# Altium schematic sheet USB_OTG_FS.SchDoc
size A4; DocumentNumber: 5; Revision: C.1(PCB.SCH); SheetNumber: 5; SheetTotal: 6
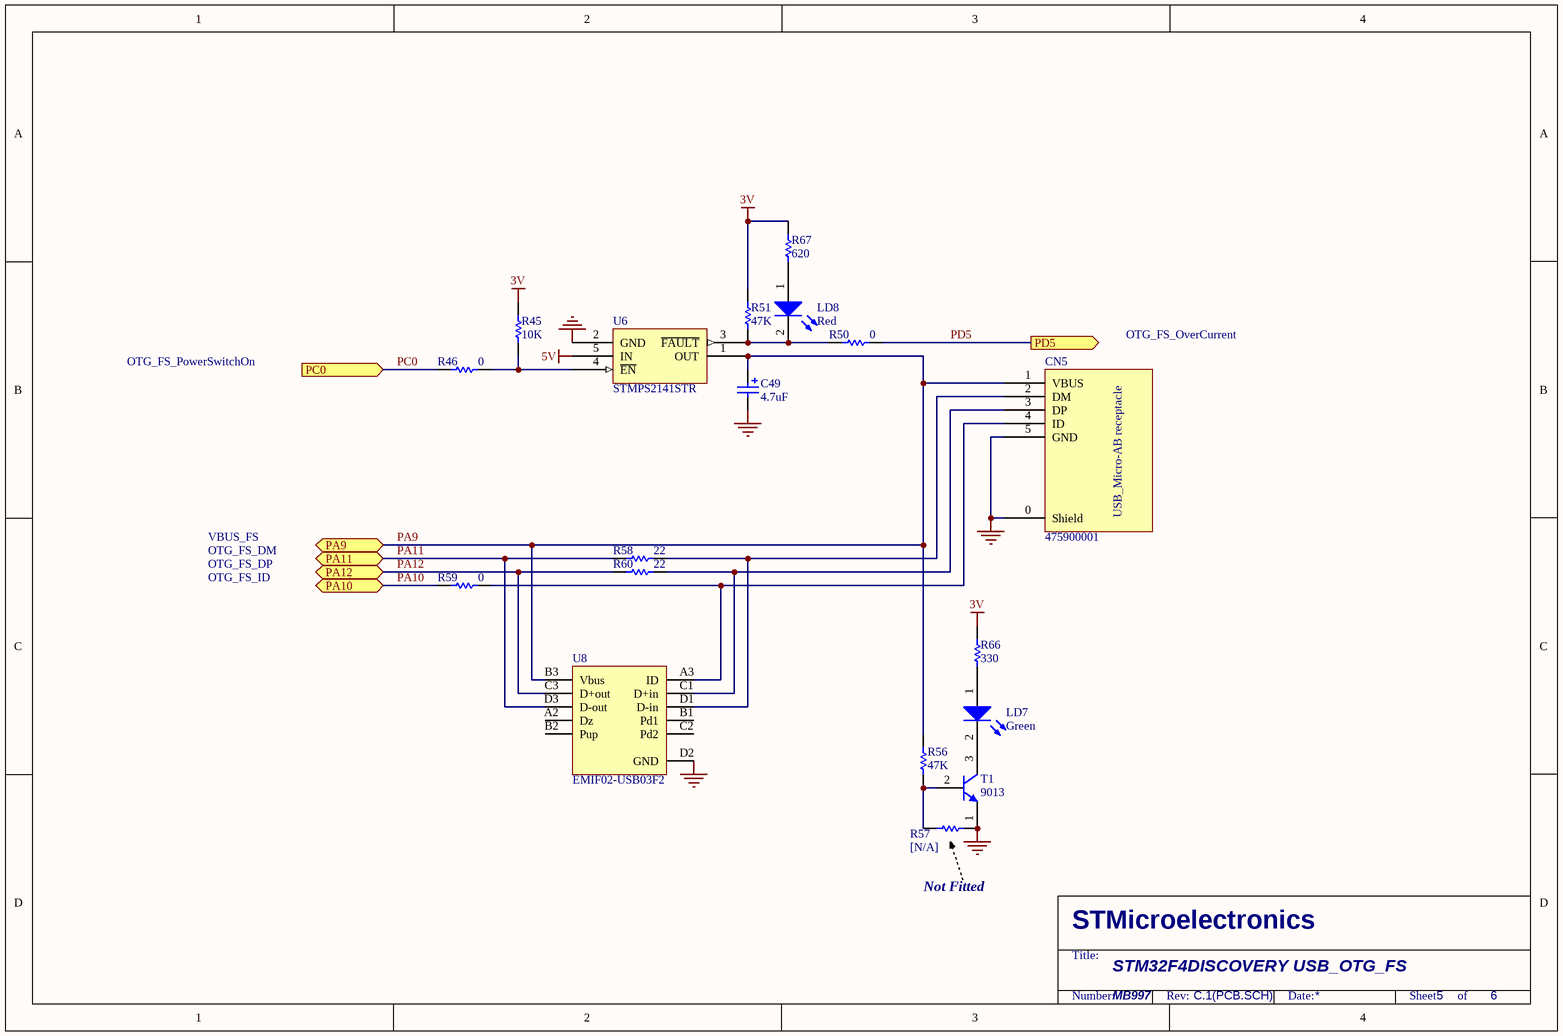
[diagram p0: USB_OTG_FS.SchDoc]

## Parts
C49  4.7uF  [TAN-A]
CN5  475900001  [USB-MICRO-AB]
LD7  Green  [0603D]
LD8  Red  [0603D]
R45  10K  [0402R]
R46  0  [0603R]
R50  0  [0603R]
R51  47K  [0402R]
R56  47K  [0402R]
R57  [N/A]  [0603R]
R58  22  [0603R]
R59  0  [0603R]
R60  22  [0603R]
R66  330  [0603R]
R67  620  [0603R]
T1  9013  [SOT-23]
U6  STMPS2141STR  [SOT23-5L]
U8  EMIF02-USB03F2  [Flip Chip]

## Ports
PA9 (bidir), PA10 (bidir), PA11 (bidir), PA12 (bidir), PC0 (in), PD5 (out)

## Nets
3V: R45.1 R51.1 R66.2 R67.2
5V: U6.5(IN)
GND: C49.2 CN5.0(Shield) CN5.5(GND) R57.1 T1.1(E) U6.2(GND) U8.D2(GND)
PA9: C49.1 CN5.1(VBUS) R56.2 U6.1(OUT) U8.B3(Vbus) ; port PA9
PA10: R59.2 ; port PA10
PA11: R58.2 U8.D3(D-out) ; port PA11
PA12: R60.2 U8.C3(D+out) ; port PA12
PC0: R46.2 ; port PC0
PD5: R50.1 ; port PD5
NetCN5_2: CN5.2(DM) R58.1 U8.D1(D-in)
NetCN5_3: CN5.3(DP) R60.1 U8.C1(D+in)
NetCN5_4: CN5.4(ID) R59.1 U8.A3(ID)
NetLD7_1: LD7.1(A) R66.1
NetLD7_2: LD7.2(K) T1.3(C)
NetLD8_1: LD8.1(A) R67.1
NetLD8_2: LD8.2(K) R50.2 R51.2 U6.3(~{FAULT})
NetR45_2: R45.2 R46.1 U6.4(~{EN})
NetR56_1: R56.1 R57.2 T1.2(B)

Not connected (* = marked no-connect by the designer): U8 A2(Dz) B1(Pd1) B2(Pup) C2(Pd2)

## Notes on the sheet
- OTG_FS_PowerSwitchOn
- OTG_FS_OverCurrent
- VBUS_FS
- OTG_FS_ID
- OTG_FS_DM
- OTG_FS_DP
- Not Fitted
- STM32F4DISCOVERY USB_OTG_FS
- MB997
- STMicroelectronics
- Title:
- Number:
- Rev:
- Date:
- Sheet       of
- (in symbol 475900001) USB_Micro-AB receptacle

## Library data of the parts
C49 = Cap Pol1: Polarized Capacitor (Radial); Value: 47uF; Published: 8-Jun-2000; Revision: July-2002: Re-released for DXP Platform.; Publisher: Altium Limited
LD7 LD8 = LED2: Typical RED, GREEN, YELLOW, AMBER GaAs LED; Published: 8-Jun-2000; Revision: July-2002: Re-released for DXP Platform.; Publisher: Altium Limited
R45 R51 R56 R66 = res1: Resistor; Value: 1K; Published: 8-Jun-2000; Revision: July-2002: Re-released for DXP Platform.; Publisher: Altium Limited
R46 R50 R58-R60 R67 = Res1: Resistor; Value: 1K; Published: 8-Jun-2000; Revision: July-2002: Re-released for DXP Platform.; Publisher: Altium Limited
R57 = res1: Resistor; Value: 1K; Fitted: NO; Published: 8-Jun-2000; Revision: July-2002: Re-released for DXP Platform.; Publisher: Altium Limited
T1 = NPN: NPN Bipolar Transistor; Code - JEDEC: TO-226-AA; Published: 8-Jun-2000; Revision: July-2002: Re-released for DXP Platform.; Publisher: Altium Limited
U6 = STMPS2141STR: Enhanced single channel power switches; Manuf_1: STM; Provided: ST; Order: STMPS2141STR; Manuf_Part_1: STMPS2141STR
U8 = EMIF02-USB03F2: 2-line IPAD, EMI filter including ESD protection; Manuf_1: STM; Provided: ST; Order: EMIF02-USB03F2; Manuf_Part_1: EMIF02-USB03F2